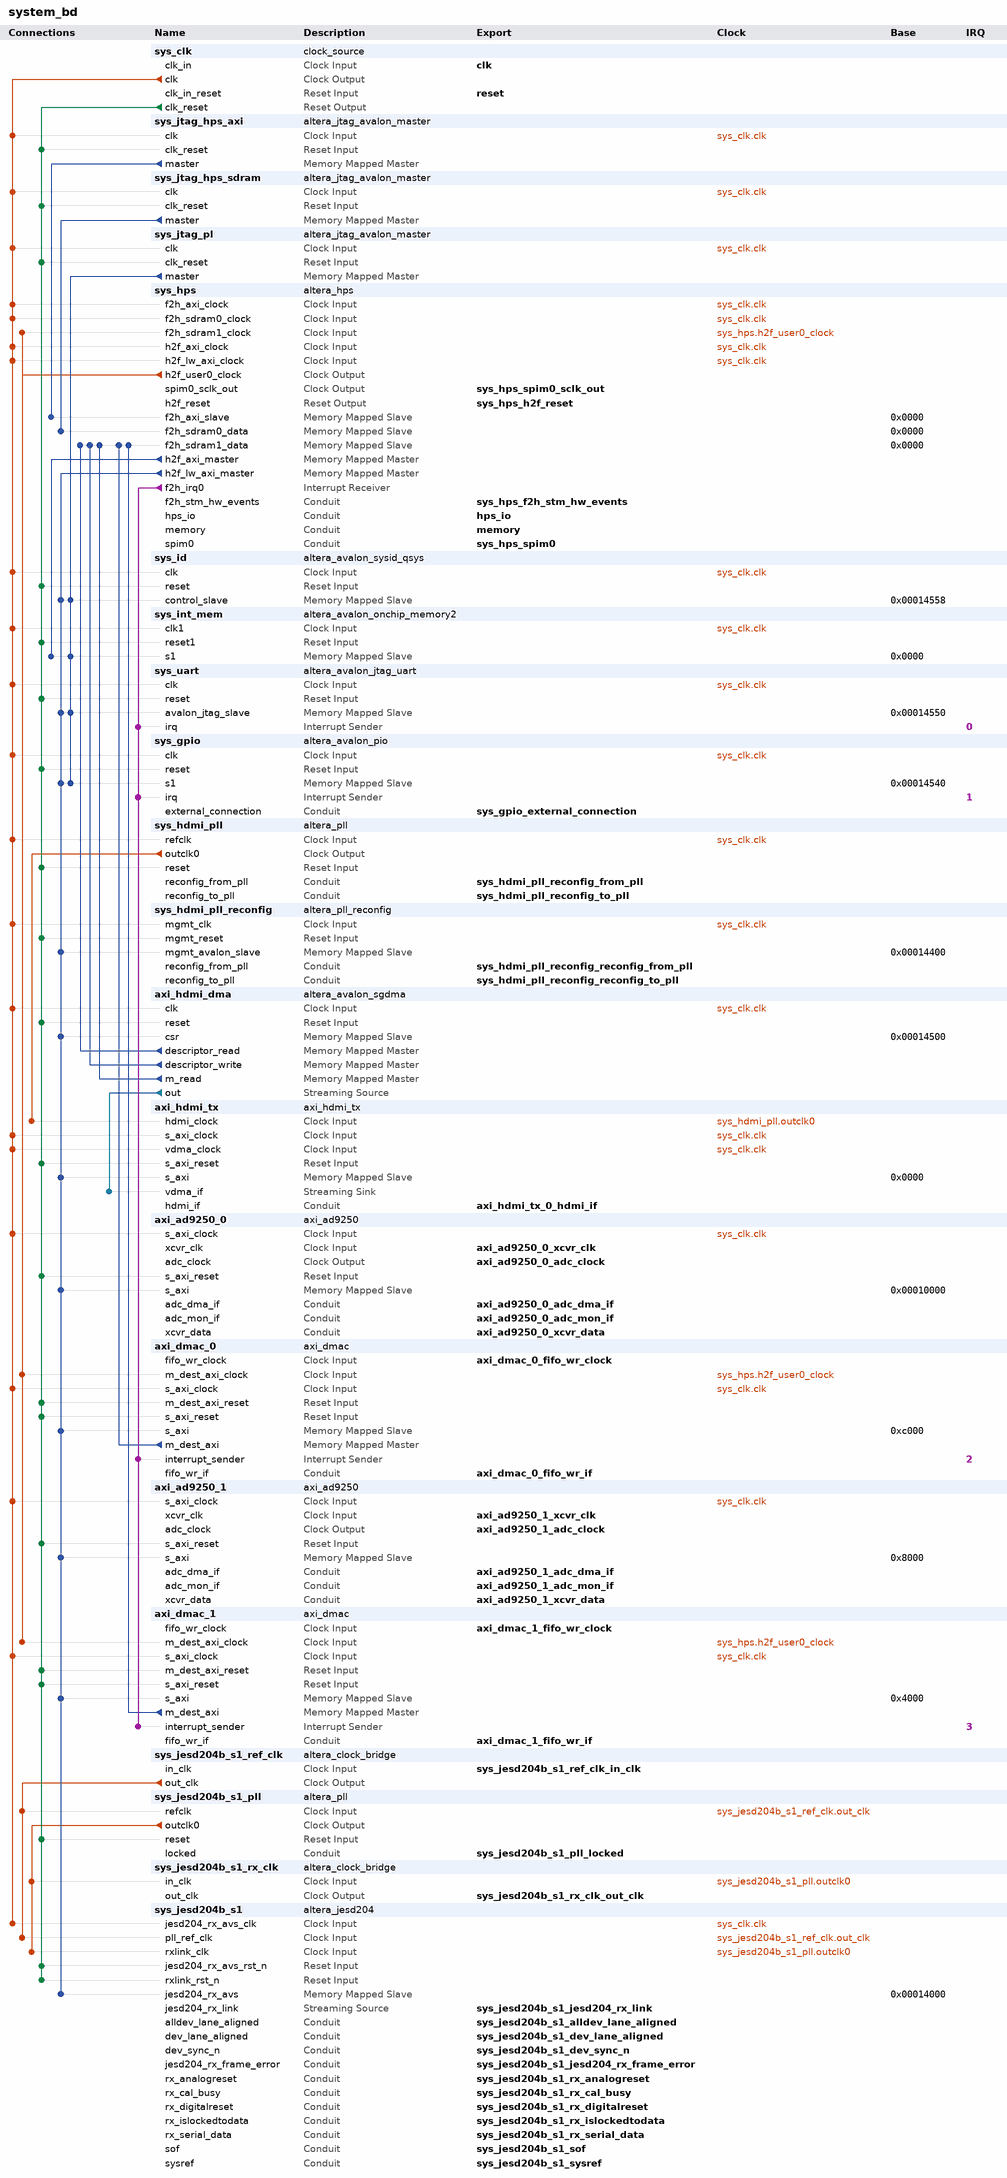
[diagram p0: system contents]
# Platform Designer (Qsys) system system_bd, Arria V 5ASTFD5K3F40I3ES
# Parameters at their usual value, and those the tool derives, are not listed.
package require -exact qsys 13.1
create_system system_bd
set_project_property DEVICE_FAMILY {Arria V}
set_project_property DEVICE 5ASTFD5K3F40I3ES

add_instance sys_clk clock_source 13.1
set_instance_parameter_value sys_clk clockFrequency 100000000

add_instance sys_jtag_hps_axi altera_jtag_avalon_master 13.1

add_instance sys_jtag_hps_sdram altera_jtag_avalon_master 13.1

add_instance sys_jtag_pl altera_jtag_avalon_master 13.1

add_instance sys_hps altera_hps 13.1
set_instance_parameter_value sys_hps MEM_VENDOR JEDEC
set_instance_parameter_value sys_hps MEM_ROW_ADDR_WIDTH 15
set_instance_parameter_value sys_hps MEM_COL_ADDR_WIDTH 10
set_instance_parameter_value sys_hps MEM_DQ_WIDTH 40
set_instance_parameter_value sys_hps MEM_BANKADDR_WIDTH 3
set_instance_parameter_value sys_hps MEM_DRV_STR RZQ/6
set_instance_parameter_value sys_hps MEM_RTT_NOM RZQ/4
set_instance_parameter_value sys_hps MEM_RTT_WR {Dynamic ODT off}
set_instance_parameter_value sys_hps MEM_WTCL 6
set_instance_parameter_value sys_hps MEM_TCL 7
set_instance_parameter_value sys_hps TIMING_TIS 170
set_instance_parameter_value sys_hps TIMING_TIH 120
set_instance_parameter_value sys_hps TIMING_TDS 10
set_instance_parameter_value sys_hps TIMING_TDH 45
set_instance_parameter_value sys_hps TIMING_TDQSQ 100
set_instance_parameter_value sys_hps TIMING_TDQSCK 225
set_instance_parameter_value sys_hps TIMING_TDQSS 0.27
set_instance_parameter_value sys_hps TIMING_TQSH 0.4
set_instance_parameter_value sys_hps TIMING_TDSH 0.18
set_instance_parameter_value sys_hps TIMING_TDSS 0.18
set_instance_parameter_value sys_hps MEM_TRAS_NS 35.0
set_instance_parameter_value sys_hps MEM_TRCD_NS 13.75
set_instance_parameter_value sys_hps MEM_TRP_NS 13.75
set_instance_parameter_value sys_hps MEM_TRFC_NS 260.0
set_instance_parameter_value sys_hps MEM_TFAW_NS 35.0
set_instance_parameter_value sys_hps MEM_TRRD_NS 6.0
set_instance_parameter_value sys_hps REF_CLK_FREQ 25.0
set_instance_parameter_value sys_hps DEFAULT_FAST_SIM_MODEL true
set_instance_parameter_value sys_hps TIMING_BOARD_MAX_CK_DELAY 0.6
set_instance_parameter_value sys_hps TIMING_BOARD_MAX_DQS_DELAY 0.6
set_instance_parameter_value sys_hps TIMING_BOARD_SKEW_CKDQS_DIMM_MIN -0.01
set_instance_parameter_value sys_hps TIMING_BOARD_SKEW_CKDQS_DIMM_MAX 0.01
set_instance_parameter_value sys_hps TIMING_BOARD_SKEW_WITHIN_DQS 0.02
set_instance_parameter_value sys_hps TIMING_BOARD_SKEW_BETWEEN_DQS 0.02
set_instance_parameter_value sys_hps TIMING_BOARD_DQ_TO_DQS_SKEW 0.0
set_instance_parameter_value sys_hps TIMING_BOARD_AC_SKEW 0.02
set_instance_parameter_value sys_hps TIMING_BOARD_AC_TO_CK_SKEW 0.0
set_instance_parameter_value sys_hps MEM_CLK_FREQ 400.0
set_instance_parameter_value sys_hps HPS_PROTOCOL DDR3
set_instance_parameter_value sys_hps STM_Enable true
set_instance_parameter_value sys_hps F2S_Width 2
set_instance_parameter_value sys_hps S2F_Width 2
set_instance_parameter_value sys_hps LWH2F_Enable true
set_instance_parameter_value sys_hps F2SDRAM_Type {Avalon-MM Bidirectional,Avalon-MM Bidirectional}
set_instance_parameter_value sys_hps F2SDRAM_Width 64,64
set_instance_parameter_value sys_hps F2SCLK_DBGRST_Enable false
set_instance_parameter_value sys_hps F2SCLK_WARMRST_Enable false
set_instance_parameter_value sys_hps F2SCLK_COLDRST_Enable false
set_instance_parameter_value sys_hps F2SINTERRUPT_Enable true
set_instance_parameter_value sys_hps EMAC1_PinMuxing {HPS I/O Set 0}
set_instance_parameter_value sys_hps EMAC1_Mode RGMII
set_instance_parameter_value sys_hps QSPI_PinMuxing {HPS I/O Set 0}
set_instance_parameter_value sys_hps QSPI_Mode {1 SS}
set_instance_parameter_value sys_hps SDIO_PinMuxing {HPS I/O Set 0}
set_instance_parameter_value sys_hps SDIO_Mode {4-bit Data}
set_instance_parameter_value sys_hps USB1_PinMuxing {HPS I/O Set 0}
set_instance_parameter_value sys_hps USB1_Mode SDR
set_instance_parameter_value sys_hps SPIM0_PinMuxing FPGA
set_instance_parameter_value sys_hps SPIM0_Mode Full
set_instance_parameter_value sys_hps SPIM1_PinMuxing Unused
set_instance_parameter_value sys_hps SPIM1_Mode N/A
set_instance_parameter_value sys_hps UART0_PinMuxing {HPS I/O Set 1}
set_instance_parameter_value sys_hps UART0_Mode {No Flow Control}
set_instance_parameter_value sys_hps UART1_PinMuxing {HPS I/O Set 0}
set_instance_parameter_value sys_hps UART1_Mode {No Flow Control}
set_instance_parameter_value sys_hps I2C0_PinMuxing {HPS I/O Set 0}
set_instance_parameter_value sys_hps I2C0_Mode I2C
set_instance_parameter_value sys_hps I2C1_PinMuxing Unused
set_instance_parameter_value sys_hps I2C1_Mode N/A
set_instance_parameter_value sys_hps TRACE_PinMuxing {HPS I/O Set 0}
set_instance_parameter_value sys_hps TRACE_Mode HPS
set_instance_parameter_value sys_hps S2FCLK_USER0CLK_Enable true
set_instance_parameter_value sys_hps S2FCLK_USER1CLK_FREQ 150
set_instance_parameter_value sys_hps FPGA_PERIPHERAL_OUTPUT_CLOCK_FREQ_EMAC0_MD_CLK 100
set_instance_parameter_value sys_hps FPGA_PERIPHERAL_OUTPUT_CLOCK_FREQ_EMAC0_GTX_CLK 100
set_instance_parameter_value sys_hps FPGA_PERIPHERAL_OUTPUT_CLOCK_FREQ_EMAC1_MD_CLK 100
set_instance_parameter_value sys_hps FPGA_PERIPHERAL_OUTPUT_CLOCK_FREQ_EMAC1_GTX_CLK 100
set_instance_parameter_value sys_hps FPGA_PERIPHERAL_OUTPUT_CLOCK_FREQ_SPIM0_SCLK_OUT 20

add_instance sys_id altera_avalon_sysid_qsys 13.1
set_instance_parameter_value sys_id id -1395322095

add_instance sys_int_mem altera_avalon_onchip_memory2 13.1
set_instance_parameter_value sys_int_mem dataWidth 64
set_instance_parameter_value sys_int_mem dualPort false
set_instance_parameter_value sys_int_mem initMemContent true
set_instance_parameter_value sys_int_mem initializationFileName onchip_memory2_0
set_instance_parameter_value sys_int_mem memorySize 65536

add_instance sys_uart altera_avalon_jtag_uart 13.1
set_instance_parameter_value sys_uart allowMultipleConnections true
set_instance_parameter_value sys_uart simInteractiveOptions INTERACTIVE_ASCII_OUTPUT

add_instance sys_gpio altera_avalon_pio 13.1
set_instance_parameter_value sys_gpio bitClearingEdgeCapReg true
set_instance_parameter_value sys_gpio captureEdge true
set_instance_parameter_value sys_gpio direction InOut
set_instance_parameter_value sys_gpio edgeType FALLING
set_instance_parameter_value sys_gpio generateIRQ true
set_instance_parameter_value sys_gpio irqType EDGE
set_instance_parameter_value sys_gpio width 32

add_instance sys_hdmi_pll altera_pll 13.1
set_instance_parameter_value sys_hdmi_pll gui_device_speed_grade 2
set_instance_parameter_value sys_hdmi_pll gui_pll_mode {Integer-N PLL}
set_instance_parameter_value sys_hdmi_pll gui_reference_clock_frequency 100.0
set_instance_parameter_value sys_hdmi_pll gui_operation_mode direct
set_instance_parameter_value sys_hdmi_pll gui_use_locked false
set_instance_parameter_value sys_hdmi_pll gui_number_of_clocks 1
set_instance_parameter_value sys_hdmi_pll gui_output_clock_frequency0 148.484848
set_instance_parameter_value sys_hdmi_pll gui_en_reconf true

add_instance sys_hdmi_pll_reconfig altera_pll_reconfig 13.1
set_instance_parameter_value sys_hdmi_pll_reconfig ENABLE_MIF 0

add_instance axi_hdmi_dma altera_avalon_sgdma 13.1
set_instance_parameter_value axi_hdmi_dma enableBurstTransfers false
set_instance_parameter_value axi_hdmi_dma enableUnalignedTransfers false
set_instance_parameter_value axi_hdmi_dma readBlockDataWidth 64
set_instance_parameter_value axi_hdmi_dma sinkErrorWidth 0
set_instance_parameter_value axi_hdmi_dma sourceErrorWidth 0
set_instance_parameter_value axi_hdmi_dma transferMode MEMORY_TO_STREAM
set_instance_parameter_value axi_hdmi_dma writeBurstcountWidth 4

add_instance axi_hdmi_tx axi_hdmi_tx 1.0
set_instance_parameter_value axi_hdmi_tx PCORE_ID 0
set_instance_parameter_value axi_hdmi_tx PCORE_DEVICE_TYPE 16
set_instance_parameter_value axi_hdmi_tx PCORE_AXI_ID_WIDTH 14
set_instance_parameter_value axi_hdmi_tx PCORE_Cr_Cb_N 0
set_instance_parameter_value axi_hdmi_tx PCORE_EMBEDDED_SYNC 0

add_instance axi_ad9250_0 axi_ad9250 1.0
set_instance_parameter_value axi_ad9250_0 PCORE_ID 0
set_instance_parameter_value axi_ad9250_0 PCORE_DEVICE_TYPE 0
set_instance_parameter_value axi_ad9250_0 PCORE_AXI_ID_WIDTH 14

add_instance axi_dmac_0 axi_dmac 1.0
set_instance_parameter_value axi_dmac_0 PCORE_ID 0
set_instance_parameter_value axi_dmac_0 PCORE_AXI_ID_WIDTH 14
set_instance_parameter_value axi_dmac_0 C_DMA_DATA_WIDTH_SRC 64
set_instance_parameter_value axi_dmac_0 C_DMA_DATA_WIDTH_DEST 64
set_instance_parameter_value axi_dmac_0 C_DMA_LENGTH_WIDTH 14
set_instance_parameter_value axi_dmac_0 C_2D_TRANSFER 1
set_instance_parameter_value axi_dmac_0 C_CLKS_ASYNC_REQ_SRC 1
set_instance_parameter_value axi_dmac_0 C_CLKS_ASYNC_SRC_DEST 1
set_instance_parameter_value axi_dmac_0 C_CLKS_ASYNC_DEST_REQ 1
set_instance_parameter_value axi_dmac_0 C_AXI_SLICE_DEST 0
set_instance_parameter_value axi_dmac_0 C_AXI_SLICE_SRC 0
set_instance_parameter_value axi_dmac_0 C_SYNC_TRANSFER_START 0
set_instance_parameter_value axi_dmac_0 C_CYCLIC 1
set_instance_parameter_value axi_dmac_0 C_DMA_TYPE_DEST 0
set_instance_parameter_value axi_dmac_0 C_DMA_TYPE_SRC 2

add_instance axi_ad9250_1 axi_ad9250 1.0
set_instance_parameter_value axi_ad9250_1 PCORE_ID 1
set_instance_parameter_value axi_ad9250_1 PCORE_DEVICE_TYPE 0
set_instance_parameter_value axi_ad9250_1 PCORE_AXI_ID_WIDTH 14

add_instance axi_dmac_1 axi_dmac 1.0
set_instance_parameter_value axi_dmac_1 PCORE_ID 1
set_instance_parameter_value axi_dmac_1 PCORE_AXI_ID_WIDTH 14
set_instance_parameter_value axi_dmac_1 C_DMA_DATA_WIDTH_SRC 64
set_instance_parameter_value axi_dmac_1 C_DMA_DATA_WIDTH_DEST 64
set_instance_parameter_value axi_dmac_1 C_DMA_LENGTH_WIDTH 14
set_instance_parameter_value axi_dmac_1 C_2D_TRANSFER 1
set_instance_parameter_value axi_dmac_1 C_CLKS_ASYNC_REQ_SRC 1
set_instance_parameter_value axi_dmac_1 C_CLKS_ASYNC_SRC_DEST 1
set_instance_parameter_value axi_dmac_1 C_CLKS_ASYNC_DEST_REQ 1
set_instance_parameter_value axi_dmac_1 C_AXI_SLICE_DEST 0
set_instance_parameter_value axi_dmac_1 C_AXI_SLICE_SRC 0
set_instance_parameter_value axi_dmac_1 C_SYNC_TRANSFER_START 0
set_instance_parameter_value axi_dmac_1 C_CYCLIC 1
set_instance_parameter_value axi_dmac_1 C_DMA_TYPE_DEST 0
set_instance_parameter_value axi_dmac_1 C_DMA_TYPE_SRC 2

add_instance sys_jesd204b_s1_ref_clk altera_clock_bridge 13.1
set_instance_parameter_value sys_jesd204b_s1_ref_clk DERIVED_CLOCK_RATE 0
set_instance_parameter_value sys_jesd204b_s1_ref_clk EXPLICIT_CLOCK_RATE 250000000

add_instance sys_jesd204b_s1_pll altera_pll 13.1
set_instance_parameter_value sys_jesd204b_s1_pll gui_device_speed_grade 2
set_instance_parameter_value sys_jesd204b_s1_pll gui_pll_mode {Integer-N PLL}
set_instance_parameter_value sys_jesd204b_s1_pll gui_reference_clock_frequency 250.0
set_instance_parameter_value sys_jesd204b_s1_pll gui_operation_mode direct
set_instance_parameter_value sys_jesd204b_s1_pll gui_use_locked true
set_instance_parameter_value sys_jesd204b_s1_pll gui_number_of_clocks 1
set_instance_parameter_value sys_jesd204b_s1_pll gui_output_clock_frequency0 125.0

add_instance sys_jesd204b_s1_rx_clk altera_clock_bridge 13.1
set_instance_parameter_value sys_jesd204b_s1_rx_clk DERIVED_CLOCK_RATE 125000000
set_instance_parameter_value sys_jesd204b_s1_rx_clk EXPLICIT_CLOCK_RATE 125000000

add_instance sys_jesd204b_s1 altera_jesd204 13.1
set_instance_parameter_value sys_jesd204b_s1 wrapper_opt base_phy
set_instance_parameter_value sys_jesd204b_s1 sdc_constraint 1.0
set_instance_parameter_value sys_jesd204b_s1 DATA_PATH RX
set_instance_parameter_value sys_jesd204b_s1 SUBCLASSV 1
set_instance_parameter_value sys_jesd204b_s1 lane_rate 5000
set_instance_parameter_value sys_jesd204b_s1 pll_type CMU
set_instance_parameter_value sys_jesd204b_s1 bonded_mode bonded
set_instance_parameter_value sys_jesd204b_s1 REFCLK_FREQ 250.0
set_instance_parameter_value sys_jesd204b_s1 pll_reconfig_enable false
set_instance_parameter_value sys_jesd204b_s1 bitrev_en false
set_instance_parameter_value sys_jesd204b_s1 L 4
set_instance_parameter_value sys_jesd204b_s1 M 4
set_instance_parameter_value sys_jesd204b_s1 N 16
set_instance_parameter_value sys_jesd204b_s1 N_PRIME 16
set_instance_parameter_value sys_jesd204b_s1 S 1
set_instance_parameter_value sys_jesd204b_s1 K 32
set_instance_parameter_value sys_jesd204b_s1 SCR 1
set_instance_parameter_value sys_jesd204b_s1 CS 0
set_instance_parameter_value sys_jesd204b_s1 CF 0
set_instance_parameter_value sys_jesd204b_s1 HD 0
set_instance_parameter_value sys_jesd204b_s1 ECC_EN 0
set_instance_parameter_value sys_jesd204b_s1 DLB_TEST 0
set_instance_parameter_value sys_jesd204b_s1 PHADJ 0
set_instance_parameter_value sys_jesd204b_s1 ADJCNT 0
set_instance_parameter_value sys_jesd204b_s1 ADJDIR 0
set_instance_parameter_value sys_jesd204b_s1 OPTIMIZE 0
set_instance_parameter_value sys_jesd204b_s1 DID 0
set_instance_parameter_value sys_jesd204b_s1 BID 0
set_instance_parameter_value sys_jesd204b_s1 LID0 0
set_instance_parameter_value sys_jesd204b_s1 LID1 1
set_instance_parameter_value sys_jesd204b_s1 LID2 2
set_instance_parameter_value sys_jesd204b_s1 LID3 3
set_instance_parameter_value sys_jesd204b_s1 LID4 4
set_instance_parameter_value sys_jesd204b_s1 LID5 5
set_instance_parameter_value sys_jesd204b_s1 LID6 6
set_instance_parameter_value sys_jesd204b_s1 LID7 7
set_instance_parameter_value sys_jesd204b_s1 JESDV 1
set_instance_parameter_value sys_jesd204b_s1 RES1 0
set_instance_parameter_value sys_jesd204b_s1 RES2 0
set_instance_parameter_value sys_jesd204b_s1 TEST_COMPONENTS_EN false
set_instance_parameter_value sys_jesd204b_s1 TERMINATE_RECONFIG_EN false

# connections
add_connection sys_clk.clk axi_ad9250_0.s_axi_clock clock
add_connection sys_clk.clk axi_ad9250_1.s_axi_clock clock
add_connection sys_clk.clk axi_dmac_0.s_axi_clock clock
add_connection sys_clk.clk axi_dmac_1.s_axi_clock clock
add_connection sys_clk.clk axi_hdmi_dma.clk clock
add_connection sys_clk.clk axi_hdmi_tx.s_axi_clock clock
add_connection sys_clk.clk axi_hdmi_tx.vdma_clock clock
add_connection sys_clk.clk sys_gpio.clk clock
add_connection sys_clk.clk sys_hdmi_pll.refclk clock
add_connection sys_clk.clk sys_hdmi_pll_reconfig.mgmt_clk clock
add_connection sys_clk.clk sys_hps.f2h_axi_clock clock
add_connection sys_clk.clk sys_hps.f2h_sdram0_clock clock
add_connection sys_clk.clk sys_hps.h2f_axi_clock clock
add_connection sys_clk.clk sys_hps.h2f_lw_axi_clock clock
add_connection sys_clk.clk sys_id.clk clock
add_connection sys_clk.clk sys_int_mem.clk1 clock
add_connection sys_clk.clk sys_jesd204b_s1.jesd204_rx_avs_clk clock
add_connection sys_clk.clk sys_jtag_hps_axi.clk clock
add_connection sys_clk.clk sys_jtag_hps_sdram.clk clock
add_connection sys_clk.clk sys_jtag_pl.clk clock
add_connection sys_clk.clk sys_uart.clk clock
add_connection sys_hdmi_pll.outclk0 axi_hdmi_tx.hdmi_clock clock
add_connection sys_hps.h2f_user0_clock axi_dmac_0.m_dest_axi_clock clock
add_connection sys_hps.h2f_user0_clock axi_dmac_1.m_dest_axi_clock clock
add_connection sys_hps.h2f_user0_clock sys_hps.f2h_sdram1_clock clock
add_connection sys_jesd204b_s1_pll.outclk0 sys_jesd204b_s1.rxlink_clk clock
add_connection sys_jesd204b_s1_pll.outclk0 sys_jesd204b_s1_rx_clk.in_clk clock
add_connection sys_jesd204b_s1_ref_clk.out_clk sys_jesd204b_s1.pll_ref_clk clock
add_connection sys_jesd204b_s1_ref_clk.out_clk sys_jesd204b_s1_pll.refclk clock
add_connection sys_clk.clk_reset axi_ad9250_0.s_axi_reset reset
add_connection sys_clk.clk_reset axi_ad9250_1.s_axi_reset reset
add_connection sys_clk.clk_reset axi_dmac_0.m_dest_axi_reset reset
add_connection sys_clk.clk_reset axi_dmac_0.s_axi_reset reset
add_connection sys_clk.clk_reset axi_dmac_1.m_dest_axi_reset reset
add_connection sys_clk.clk_reset axi_dmac_1.s_axi_reset reset
add_connection sys_clk.clk_reset axi_hdmi_dma.reset reset
add_connection sys_clk.clk_reset axi_hdmi_tx.s_axi_reset reset
add_connection sys_clk.clk_reset sys_gpio.reset reset
add_connection sys_clk.clk_reset sys_hdmi_pll.reset reset
add_connection sys_clk.clk_reset sys_hdmi_pll_reconfig.mgmt_reset reset
add_connection sys_clk.clk_reset sys_id.reset reset
add_connection sys_clk.clk_reset sys_int_mem.reset1 reset
add_connection sys_clk.clk_reset sys_jesd204b_s1.jesd204_rx_avs_rst_n reset
add_connection sys_clk.clk_reset sys_jesd204b_s1.rxlink_rst_n reset
add_connection sys_clk.clk_reset sys_jesd204b_s1_pll.reset reset
add_connection sys_clk.clk_reset sys_jtag_hps_axi.clk_reset reset
add_connection sys_clk.clk_reset sys_jtag_hps_sdram.clk_reset reset
add_connection sys_clk.clk_reset sys_jtag_pl.clk_reset reset
add_connection sys_clk.clk_reset sys_uart.reset reset
add_connection axi_dmac_0.m_dest_axi sys_hps.f2h_sdram1_data avalon
set_connection_parameter_value axi_dmac_0.m_dest_axi/sys_hps.f2h_sdram1_data baseAddress 0x0000
add_connection axi_dmac_1.m_dest_axi sys_hps.f2h_sdram1_data avalon
set_connection_parameter_value axi_dmac_1.m_dest_axi/sys_hps.f2h_sdram1_data baseAddress 0x0000
add_connection axi_hdmi_dma.descriptor_read sys_hps.f2h_sdram1_data avalon
set_connection_parameter_value axi_hdmi_dma.descriptor_read/sys_hps.f2h_sdram1_data baseAddress 0x0000
add_connection axi_hdmi_dma.descriptor_write sys_hps.f2h_sdram1_data avalon
set_connection_parameter_value axi_hdmi_dma.descriptor_write/sys_hps.f2h_sdram1_data baseAddress 0x0000
add_connection axi_hdmi_dma.m_read sys_hps.f2h_sdram1_data avalon
set_connection_parameter_value axi_hdmi_dma.m_read/sys_hps.f2h_sdram1_data baseAddress 0x0000
add_connection sys_hps.h2f_axi_master sys_int_mem.s1 avalon
set_connection_parameter_value sys_hps.h2f_axi_master/sys_int_mem.s1 baseAddress 0x0000
add_connection sys_hps.h2f_lw_axi_master axi_ad9250_0.s_axi avalon
set_connection_parameter_value sys_hps.h2f_lw_axi_master/axi_ad9250_0.s_axi baseAddress 0x00010000
add_connection sys_hps.h2f_lw_axi_master axi_ad9250_1.s_axi avalon
set_connection_parameter_value sys_hps.h2f_lw_axi_master/axi_ad9250_1.s_axi baseAddress 0x8000
add_connection sys_hps.h2f_lw_axi_master axi_dmac_0.s_axi avalon
set_connection_parameter_value sys_hps.h2f_lw_axi_master/axi_dmac_0.s_axi baseAddress 0xc000
add_connection sys_hps.h2f_lw_axi_master axi_dmac_1.s_axi avalon
set_connection_parameter_value sys_hps.h2f_lw_axi_master/axi_dmac_1.s_axi baseAddress 0x4000
add_connection sys_hps.h2f_lw_axi_master axi_hdmi_dma.csr avalon
set_connection_parameter_value sys_hps.h2f_lw_axi_master/axi_hdmi_dma.csr baseAddress 0x00014500
add_connection sys_hps.h2f_lw_axi_master axi_hdmi_tx.s_axi avalon
set_connection_parameter_value sys_hps.h2f_lw_axi_master/axi_hdmi_tx.s_axi baseAddress 0x0000
add_connection sys_hps.h2f_lw_axi_master sys_gpio.s1 avalon
set_connection_parameter_value sys_hps.h2f_lw_axi_master/sys_gpio.s1 baseAddress 0x00014540
add_connection sys_hps.h2f_lw_axi_master sys_hdmi_pll_reconfig.mgmt_avalon_slave avalon
set_connection_parameter_value sys_hps.h2f_lw_axi_master/sys_hdmi_pll_reconfig.mgmt_avalon_slave baseAddress 0x00014400
add_connection sys_hps.h2f_lw_axi_master sys_id.control_slave avalon
set_connection_parameter_value sys_hps.h2f_lw_axi_master/sys_id.control_slave baseAddress 0x00014558
add_connection sys_hps.h2f_lw_axi_master sys_jesd204b_s1.jesd204_rx_avs avalon
set_connection_parameter_value sys_hps.h2f_lw_axi_master/sys_jesd204b_s1.jesd204_rx_avs baseAddress 0x00014000
add_connection sys_hps.h2f_lw_axi_master sys_uart.avalon_jtag_slave avalon
set_connection_parameter_value sys_hps.h2f_lw_axi_master/sys_uart.avalon_jtag_slave baseAddress 0x00014550
add_connection sys_jtag_hps_axi.master sys_hps.f2h_axi_slave avalon
set_connection_parameter_value sys_jtag_hps_axi.master/sys_hps.f2h_axi_slave baseAddress 0x0000
add_connection sys_jtag_hps_sdram.master sys_hps.f2h_sdram0_data avalon
set_connection_parameter_value sys_jtag_hps_sdram.master/sys_hps.f2h_sdram0_data baseAddress 0x0000
add_connection sys_jtag_pl.master sys_gpio.s1 avalon
set_connection_parameter_value sys_jtag_pl.master/sys_gpio.s1 baseAddress 0x00014540
add_connection sys_jtag_pl.master sys_id.control_slave avalon
set_connection_parameter_value sys_jtag_pl.master/sys_id.control_slave baseAddress 0x00014558
add_connection sys_jtag_pl.master sys_int_mem.s1 avalon
set_connection_parameter_value sys_jtag_pl.master/sys_int_mem.s1 baseAddress 0x0000
add_connection sys_jtag_pl.master sys_uart.avalon_jtag_slave avalon
set_connection_parameter_value sys_jtag_pl.master/sys_uart.avalon_jtag_slave baseAddress 0x00014550
add_connection axi_hdmi_dma.out axi_hdmi_tx.vdma_if avalon_streaming
add_connection sys_hps.f2h_irq0 axi_dmac_0.interrupt_sender interrupt
set_connection_parameter_value sys_hps.f2h_irq0/axi_dmac_0.interrupt_sender irqNumber 2
add_connection sys_hps.f2h_irq0 axi_dmac_1.interrupt_sender interrupt
set_connection_parameter_value sys_hps.f2h_irq0/axi_dmac_1.interrupt_sender irqNumber 3
add_connection sys_hps.f2h_irq0 sys_gpio.irq interrupt
set_connection_parameter_value sys_hps.f2h_irq0/sys_gpio.irq irqNumber 1
add_connection sys_hps.f2h_irq0 sys_uart.irq interrupt
set_connection_parameter_value sys_hps.f2h_irq0/sys_uart.irq irqNumber 0

# exported interfaces
add_interface memory conduit end
set_interface_property memory EXPORT_OF sys_hps.memory
add_interface clk clock sink
set_interface_property clk EXPORT_OF sys_clk.clk_in
add_interface reset reset sink
set_interface_property reset EXPORT_OF sys_clk.clk_in_reset
add_interface axi_ad9250_0_xcvr_clk clock sink
set_interface_property axi_ad9250_0_xcvr_clk EXPORT_OF axi_ad9250_0.xcvr_clk
add_interface axi_ad9250_0_xcvr_data conduit end
set_interface_property axi_ad9250_0_xcvr_data EXPORT_OF axi_ad9250_0.xcvr_data
add_interface axi_ad9250_0_adc_clock clock source
set_interface_property axi_ad9250_0_adc_clock EXPORT_OF axi_ad9250_0.adc_clock
add_interface axi_ad9250_0_adc_dma_if conduit end
set_interface_property axi_ad9250_0_adc_dma_if EXPORT_OF axi_ad9250_0.adc_dma_if
add_interface axi_ad9250_0_adc_mon_if conduit end
set_interface_property axi_ad9250_0_adc_mon_if EXPORT_OF axi_ad9250_0.adc_mon_if
add_interface axi_dmac_0_fifo_wr_clock clock sink
set_interface_property axi_dmac_0_fifo_wr_clock EXPORT_OF axi_dmac_0.fifo_wr_clock
add_interface axi_dmac_0_fifo_wr_if conduit end
set_interface_property axi_dmac_0_fifo_wr_if EXPORT_OF axi_dmac_0.fifo_wr_if
add_interface axi_ad9250_1_xcvr_clk clock sink
set_interface_property axi_ad9250_1_xcvr_clk EXPORT_OF axi_ad9250_1.xcvr_clk
add_interface axi_ad9250_1_xcvr_data conduit end
set_interface_property axi_ad9250_1_xcvr_data EXPORT_OF axi_ad9250_1.xcvr_data
add_interface axi_ad9250_1_adc_clock clock source
set_interface_property axi_ad9250_1_adc_clock EXPORT_OF axi_ad9250_1.adc_clock
add_interface axi_ad9250_1_adc_dma_if conduit end
set_interface_property axi_ad9250_1_adc_dma_if EXPORT_OF axi_ad9250_1.adc_dma_if
add_interface axi_ad9250_1_adc_mon_if conduit end
set_interface_property axi_ad9250_1_adc_mon_if EXPORT_OF axi_ad9250_1.adc_mon_if
add_interface axi_dmac_1_fifo_wr_clock clock sink
set_interface_property axi_dmac_1_fifo_wr_clock EXPORT_OF axi_dmac_1.fifo_wr_clock
add_interface axi_dmac_1_fifo_wr_if conduit end
set_interface_property axi_dmac_1_fifo_wr_if EXPORT_OF axi_dmac_1.fifo_wr_if
add_interface sys_jesd204b_s1_ref_clk_in_clk clock sink
set_interface_property sys_jesd204b_s1_ref_clk_in_clk EXPORT_OF sys_jesd204b_s1_ref_clk.in_clk
add_interface sys_jesd204b_s1_rx_clk_out_clk clock source
set_interface_property sys_jesd204b_s1_rx_clk_out_clk EXPORT_OF sys_jesd204b_s1_rx_clk.out_clk
add_interface sys_jesd204b_s1_jesd204_rx_link avalon_streaming source
set_interface_property sys_jesd204b_s1_jesd204_rx_link EXPORT_OF sys_jesd204b_s1.jesd204_rx_link
add_interface sys_jesd204b_s1_alldev_lane_aligned conduit end
set_interface_property sys_jesd204b_s1_alldev_lane_aligned EXPORT_OF sys_jesd204b_s1.alldev_lane_aligned
add_interface sys_jesd204b_s1_sysref conduit end
set_interface_property sys_jesd204b_s1_sysref EXPORT_OF sys_jesd204b_s1.sysref
add_interface sys_jesd204b_s1_jesd204_rx_frame_error conduit end
set_interface_property sys_jesd204b_s1_jesd204_rx_frame_error EXPORT_OF sys_jesd204b_s1.jesd204_rx_frame_error
add_interface sys_jesd204b_s1_dev_lane_aligned conduit end
set_interface_property sys_jesd204b_s1_dev_lane_aligned EXPORT_OF sys_jesd204b_s1.dev_lane_aligned
add_interface sys_jesd204b_s1_dev_sync_n conduit end
set_interface_property sys_jesd204b_s1_dev_sync_n EXPORT_OF sys_jesd204b_s1.dev_sync_n
add_interface sys_jesd204b_s1_sof conduit end
set_interface_property sys_jesd204b_s1_sof EXPORT_OF sys_jesd204b_s1.sof
add_interface sys_jesd204b_s1_rx_serial_data conduit end
set_interface_property sys_jesd204b_s1_rx_serial_data EXPORT_OF sys_jesd204b_s1.rx_serial_data
add_interface sys_jesd204b_s1_rx_analogreset conduit end
set_interface_property sys_jesd204b_s1_rx_analogreset EXPORT_OF sys_jesd204b_s1.rx_analogreset
add_interface sys_jesd204b_s1_rx_digitalreset conduit end
set_interface_property sys_jesd204b_s1_rx_digitalreset EXPORT_OF sys_jesd204b_s1.rx_digitalreset
add_interface sys_jesd204b_s1_rx_islockedtodata conduit end
set_interface_property sys_jesd204b_s1_rx_islockedtodata EXPORT_OF sys_jesd204b_s1.rx_islockedtodata
add_interface sys_jesd204b_s1_rx_cal_busy conduit end
set_interface_property sys_jesd204b_s1_rx_cal_busy EXPORT_OF sys_jesd204b_s1.rx_cal_busy
add_interface sys_hps_spim0 conduit end
set_interface_property sys_hps_spim0 EXPORT_OF sys_hps.spim0
add_interface sys_jesd204b_s1_pll_locked conduit end
set_interface_property sys_jesd204b_s1_pll_locked EXPORT_OF sys_jesd204b_s1_pll.locked
add_interface sys_hps_spim0_sclk_out clock source
set_interface_property sys_hps_spim0_sclk_out EXPORT_OF sys_hps.spim0_sclk_out
add_interface sys_hps_f2h_stm_hw_events conduit end
set_interface_property sys_hps_f2h_stm_hw_events EXPORT_OF sys_hps.f2h_stm_hw_events
add_interface hps_io conduit end
set_interface_property hps_io EXPORT_OF sys_hps.hps_io
add_interface sys_hps_h2f_reset reset source
set_interface_property sys_hps_h2f_reset EXPORT_OF sys_hps.h2f_reset
add_interface sys_gpio_external_connection conduit end
set_interface_property sys_gpio_external_connection EXPORT_OF sys_gpio.external_connection
add_interface axi_hdmi_tx_0_hdmi_if conduit end
set_interface_property axi_hdmi_tx_0_hdmi_if EXPORT_OF axi_hdmi_tx.hdmi_if
add_interface sys_hdmi_pll_reconfig_to_pll conduit end
set_interface_property sys_hdmi_pll_reconfig_to_pll EXPORT_OF sys_hdmi_pll.reconfig_to_pll
add_interface sys_hdmi_pll_reconfig_from_pll conduit end
set_interface_property sys_hdmi_pll_reconfig_from_pll EXPORT_OF sys_hdmi_pll.reconfig_from_pll
add_interface sys_hdmi_pll_reconfig_reconfig_to_pll conduit end
set_interface_property sys_hdmi_pll_reconfig_reconfig_to_pll EXPORT_OF sys_hdmi_pll_reconfig.reconfig_to_pll
add_interface sys_hdmi_pll_reconfig_reconfig_from_pll conduit end
set_interface_property sys_hdmi_pll_reconfig_reconfig_from_pll EXPORT_OF sys_hdmi_pll_reconfig.reconfig_from_pll

set_interconnect_requirement {$system} qsys_mm.clockCrossingAdapter FIFO
set_interconnect_requirement {$system} qsys_mm.maxAdditionalLatency 4
set_interconnect_requirement {$system} qsys_mm.insertDefaultSlave FALSE

save_system system_bd.qsys
